# Altium schematic sheet Controle.SchDoc
size A4; SheetNumber: 2; SheetTotal: 2
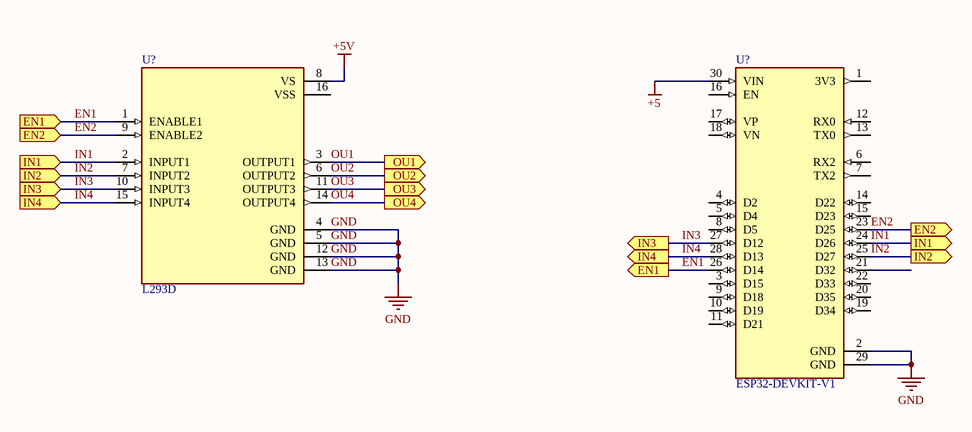
[diagram p0: Controle.SchDoc]

## Parts
(Parts that share a designator on the sheet are numbered #1, #2 ... from top to bottom, then left to right.)
U?#1  L293D  [DIP880W50P254L2000H510Q16]
U?#2  ESP32-DEVKIT-V1  [MODULE_ESP32_DEVKIT_V1]

## Ports
EN1 (in), EN1 (out), EN2 (in), EN2 (out), IN1 (in), IN1 (out), IN2 (in), IN2 (out), IN3 (in), IN3 (out), IN4 (in), IN4 (out), OU1 (out), OU2 (out), OU3 (out), OU4 (out)

## Nets
+5: U?#2.30(VIN)
+5V: U?#1.8(VS)
GND: U?#1.4(GND) U?#1.5(GND) U?#1.12(GND) U?#1.13(GND) U?#2.2(GND) U?#2.29(GND)
EN1: U?#1.1(ENABLE1) U?#2.26(D14) ; port EN1
EN2: U?#1.9(ENABLE2) U?#2.23(D25) ; port EN2
IN1: U?#1.2(INPUT1) U?#2.24(D26) ; port IN1
IN2: U?#1.7(INPUT2) U?#2.25(D27) ; port IN2
IN3: U?#1.10(INPUT3) U?#2.27(D12) ; port IN3
IN4: U?#1.15(INPUT4) U?#2.28(D13) ; port IN4
OU1: U?#1.3(OUTPUT1) ; port OU1
OU2: U?#1.6(OUTPUT2) ; port OU2
OU3: U?#1.11(OUTPUT3) ; port OU3
OU4: U?#1.14(OUTPUT4) ; port OU4

Not connected (* = marked no-connect by the designer): U?#1 16(VSS); U?#2 1(3V3) 3(D15) 4(D2) 5(D4) 6(RX2) 7(TX2) 8(D5) 9(D18) 10(D19) 11(D21) 12(RX0) 13(TX0) 14(D22) 15(D23) 16(EN) 17(VP) 18(VN) 19(D34) 20(D35) 21(D32) 22(D33)

## Notes on the sheet
- Data:
- TITULO
- Tamanho:
- A4
- Numero:
- Hora:
- Folha:
- Revision:
- De
- Arquivo:

## Library data of the parts
U?#1 = L293D: 4-Channel Motor Driver 24V 16-Pin Power PDIP Tube; MF: {'manufacturer': u'STMicroelectronics'}; Availability: Unavailable; Price: None; MP: L293D; Package: None; Value: *
U?#2 = ESP32-DEVKIT-V1: Dual core, Wi-Fi: 2.4 GHz up to 150 Mbits/s,BLE (Bluetooth Low Energy) and legacy Bluetooth, 32 bits, Up to 240 MHz; MF: {'manufacturer': u'Do it'}; Availability: Unavailable; Price: None; Value: *; MP: ESP32-DEVKIT-V1; Package: None